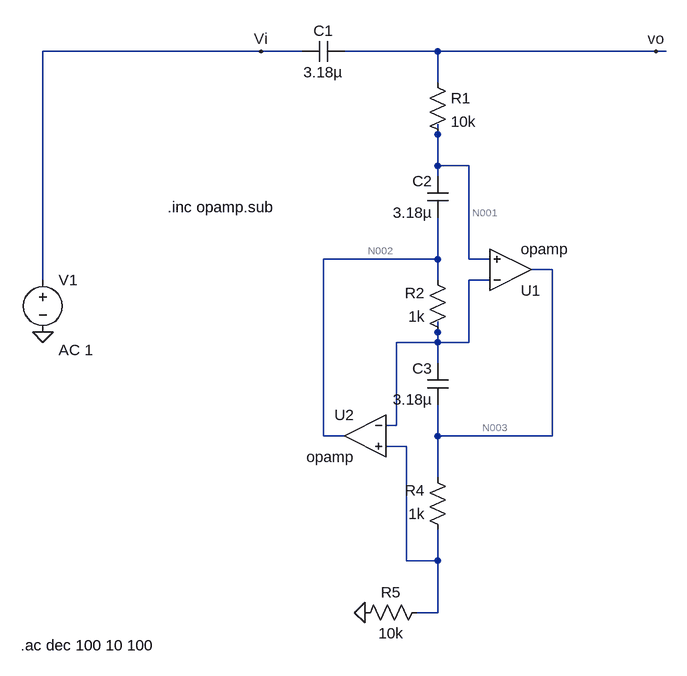
[diagram p0: schematic ej10.asc]
ej10.asc, the LTspice schematic file:
Version 4
SHEET 1 1076 1044
WIRE 48 112 -288 112
WIRE 112 112 48 112
WIRE 320 112 176 112
WIRE 656 112 320 112
WIRE 672 112 656 112
WIRE 320 160 320 112
WIRE 320 240 320 224
WIRE 320 288 320 240
WIRE 368 288 320 288
WIRE 320 304 320 288
WIRE 320 432 320 368
WIRE 320 432 144 432
WIRE 368 432 368 288
WIRE 400 432 368 432
WIRE 496 448 464 448
WIRE -288 464 -288 112
WIRE 320 464 320 432
WIRE 400 464 368 464
WIRE 320 544 320 528
WIRE 320 560 320 544
WIRE 320 560 256 560
WIRE 368 560 368 464
WIRE 368 560 320 560
WIRE 320 592 320 560
WIRE 256 688 256 560
WIRE 256 688 240 688
WIRE 144 704 144 432
WIRE 176 704 144 704
WIRE 320 704 320 656
WIRE 496 704 496 448
WIRE 496 704 320 704
WIRE 272 720 240 720
WIRE 320 768 320 704
WIRE 272 896 272 720
WIRE 320 896 320 848
WIRE 320 896 272 896
WIRE 320 976 320 896
WIRE 320 976 288 976
FLAG 48 112 Vi
FLAG 208 976 0
FLAG -288 544 0
FLAG 656 112 vo
SYMBOL res 336 560 R180
WINDOW 0 36 76 Left 2
WINDOW 3 36 40 Left 2
SYMATTR InstName R2
SYMATTR Value 1k
SYMBOL cap 336 368 R180
WINDOW 0 24 56 Left 2
WINDOW 3 24 8 Left 2
SYMATTR InstName C2
SYMATTR Value 3.18µ
SYMBOL res 336 864 R180
WINDOW 0 36 76 Left 2
WINDOW 3 36 40 Left 2
SYMATTR InstName R4
SYMATTR Value 1k
SYMBOL res 192 992 R270
WINDOW 0 32 56 VTop 2
WINDOW 3 0 56 VBottom 2
SYMATTR InstName R5
SYMATTR Value 10k
SYMBOL OpAmps\\opamp 432 512 M180
SYMATTR InstName U1
SYMBOL OpAmps\\opamp 208 640 M0
SYMATTR InstName U2
SYMBOL voltage -288 448 R0
WINDOW 123 24 124 Left 2
WINDOW 39 0 0 Left 0
SYMATTR InstName V1
SYMATTR Value ""
SYMATTR Value2 AC 1
SYMBOL cap 336 656 R180
WINDOW 0 24 56 Left 2
WINDOW 3 24 8 Left 2
SYMATTR InstName C3
SYMATTR Value 3.18µ
SYMBOL cap 176 96 R90
WINDOW 0 0 32 VBottom 2
WINDOW 3 32 32 VTop 2
SYMATTR InstName C1
SYMATTR Value 3.18µ
SYMBOL res 304 144 R0
SYMATTR InstName R1
SYMATTR Value 10k
TEXT -322 1026 Left 2 !.ac dec 100 10 100
TEXT -96 352 Left 2 !.inc opamp.sub

The netlist it stands for:
* ej10.asc
R2 N004 N002 1k
C2 N002 N001 3.18µ
R4 N005 N003 1k
R5 0 N005 10k
XU1 N004 N001 N003 opamp Aol=100K GBW=10Meg  ; pins invin noninvin out
XU2 N004 N005 N002 opamp Aol=100K GBW=10Meg  ; pins invin noninvin out
V1 Vi 0 AC 1
C3 N003 N004 3.18µ
C1 vo Vi 3.18µ
R1 vo N001 10k
.ac dec 100 10 100
.inc opamp.sub
.backanno
.end

* Results of the author's LTspice run, read from the files saved beside the schematic
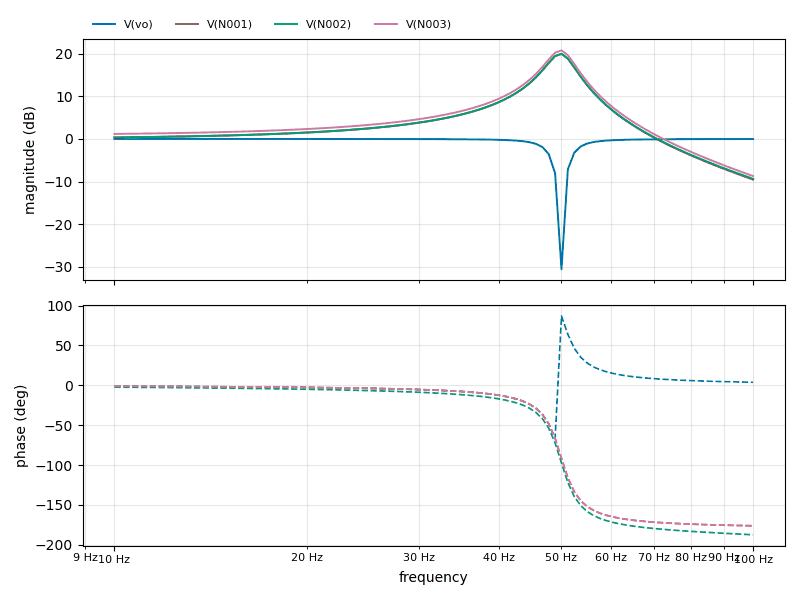
[diagram p1: AC Analysis of ej10.asc, plotted from the saved traces]
* AC Analysis, 1 run:
*   V(vo): -0.00 dB at 10 Hz, -0.02 dB at 100 Hz, peak -0.00 dB at 10 Hz, 3 dB below the peak at 47.51 Hz
*   V(N001): 0.35 dB at 10 Hz, -9.54 dB at 100 Hz, peak 19.98 dB at 50.12 Hz, 3 dB below the peak at 47.32 Hz and 52.38 Hz
*   V(N002): 0.35 dB at 10 Hz, -9.37 dB at 100 Hz, peak 20.02 dB at 50.12 Hz, 3 dB below the peak at 47.33 Hz and 52.38 Hz
*   V(N003): 1.18 dB at 10 Hz, -8.71 dB at 100 Hz, peak 20.80 dB at 50.12 Hz, 3 dB below the peak at 47.32 Hz and 52.38 Hz